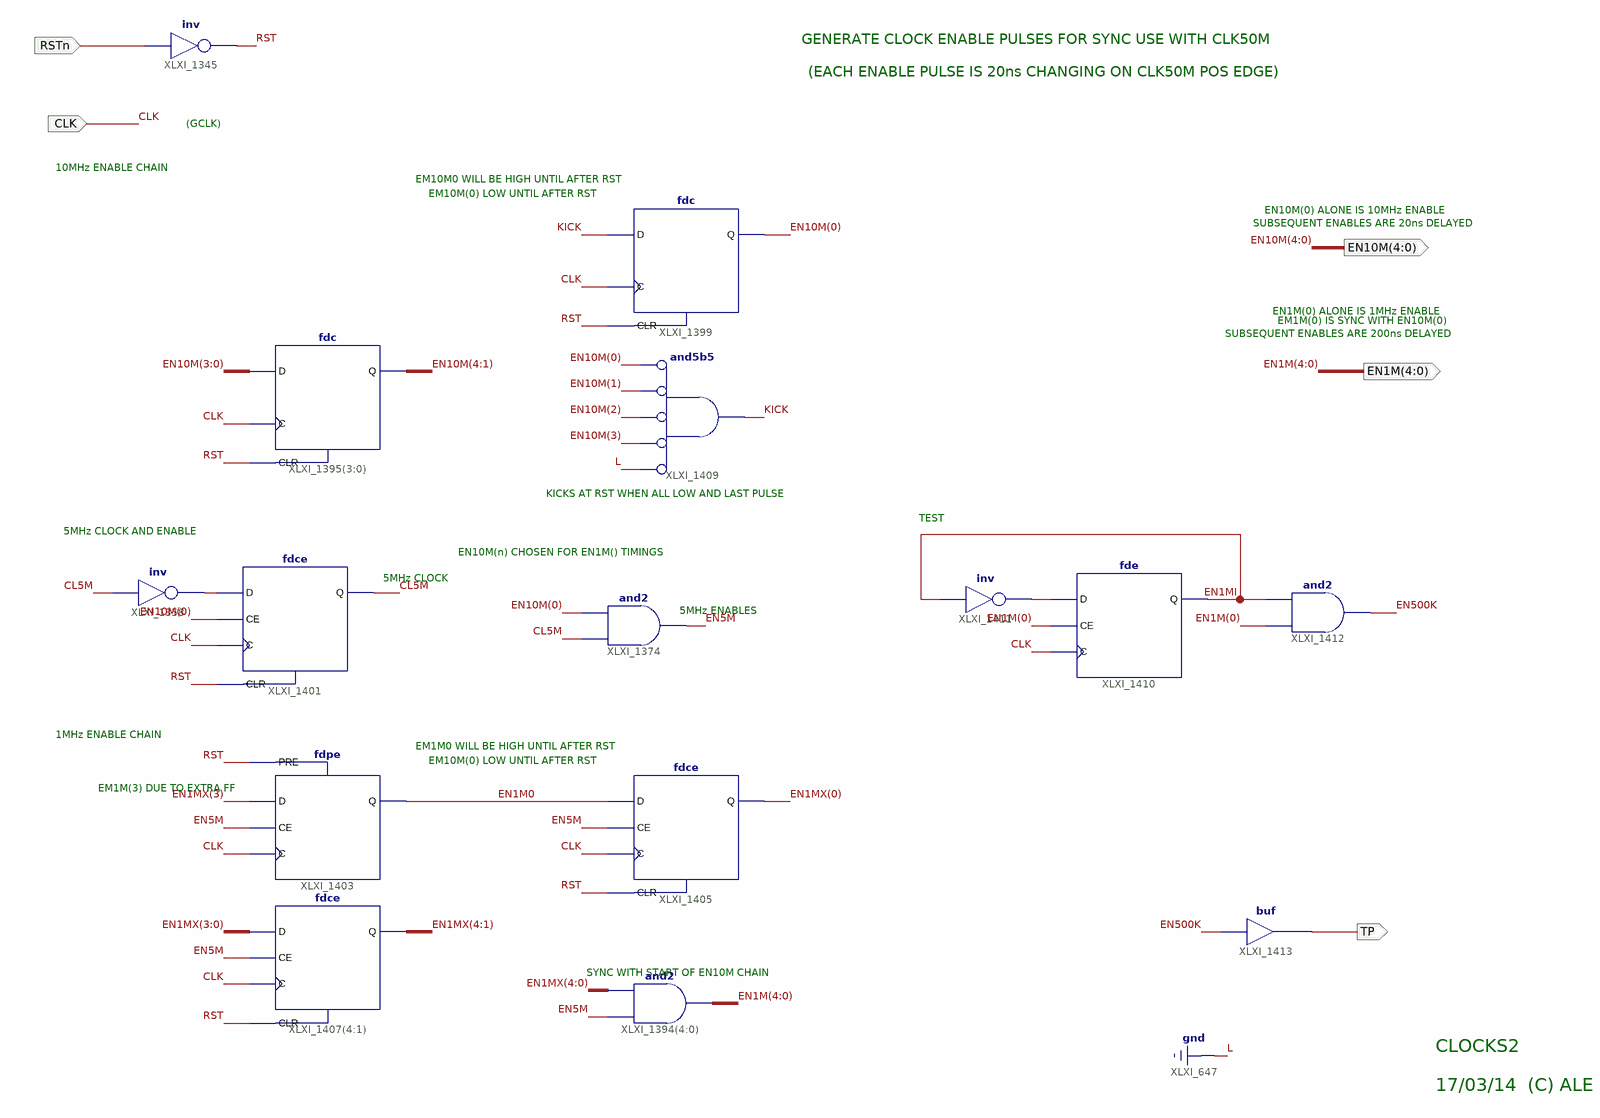
[diagram p0: schematic sheet 1]
// Xilinx ISE schematic DB_Clocks2.sch (spartan3e) as structural Verilog: 15 symbols, 5 ports
module DB_Clocks2 (
  input  RSTn,
  input  CLK,
  output [4:0] EN1M,
  output [4:0] EN10M,
  output TP
);

  wire CL5M, EN1M0, EN1MI, EN5M, EN500K, KICK, RST, XLXN_45, XLXN_46;
  wire [4:0] EN1MX;

  not XLXI_1345 (RST, RSTn);
  assign EN1M = {5{EN5M}} & EN1MX;  // and2 XLXI_1394[4..0], 5 bits wide
  not XLXI_1358 (XLXN_45, CL5M);
  and XLXI_1374 (EN5M, CL5M, EN10M[0]);
  fdc XLXI_1395[3:0] (.C(CLK), .CLR(RST), .D(EN10M[3:0]), .Q(EN10M[4:1]));
  fdc XLXI_1399 (.C(CLK), .CLR(RST), .D(KICK), .Q(EN10M[0]));
  fdce XLXI_1401 (.C(CLK), .CE(EN10M[0]), .CLR(RST), .D(XLXN_45), .Q(CL5M));
  fdpe XLXI_1403 (.C(CLK), .CE(EN5M), .D(EN1MX[3]), .PRE(RST), .Q(EN1M0));
  fdce XLXI_1405 (.C(CLK), .CE(EN5M), .CLR(RST), .D(EN1M0), .Q(EN1MX[0]));
  fdce XLXI_1407[4:1] (.C(CLK), .CE(EN5M), .CLR(RST), .D(EN1MX[3:0]), .Q(EN1MX[4:1]));
  and XLXI_1409 (KICK, ~1'b0, ~EN10M[3], ~EN10M[2], ~EN10M[1], ~EN10M[0]);  // and5b5
  fde XLXI_1410 (.C(CLK), .CE(EN1M[0]), .D(XLXN_46), .Q(EN1MI));
  not XLXI_1411 (XLXN_46, EN1MI);
  and XLXI_1412 (EN500K, EN1M[0], EN1MI);
  buf XLXI_1413 (TP, EN500K);

  // Notes on the sheet:
  //   GENERATE CLOCK ENABLE PULSES FOR SYNC USE WITH CLK50M
  //   (EACH ENABLE PULSE IS 20ns CHANGING ON CLK50M POS EDGE)
  //   (GCLK)
  //   10MHz ENABLE CHAIN
  //   EM10M0 WILL BE HIGH UNTIL AFTER RST
  //   EM10M(0) LOW UNTIL AFTER RST
  //   EN10M(0) ALONE IS 10MHz ENABLE
  //   SUBSEQUENT ENABLES ARE 20ns DELAYED
  //   EN1M(0) ALONE IS 1MHz ENABLE
  //   EM1M(0) IS SYNC WITH EN10M(0)
  //   SUBSEQUENT ENABLES ARE 200ns DELAYED
  //   KICKS AT RST WHEN ALL LOW AND LAST PULSE
  //   TEST
  //   5MHz CLOCK AND ENABLE
  //   EN10M(n) CHOSEN FOR EN1M() TIMINGS
  //   5MHz CLOCK
  //   5MHz ENABLES
  //   1MHz ENABLE CHAIN
  //   EM1M0 WILL BE HIGH UNTIL AFTER RST
  //   EM10M(0) LOW UNTIL AFTER RST
  //   EM1M(3) DUE TO EXTRA FF
  //   SYNC WITH START OF EN10M CHAIN
  //   CLOCKS2
  //   17/03/14  (C) ALE
endmodule
